# Altium schematic sheet Solar Batter Charger SCH_1.SchDoc
size A3; SheetNumber: 1; SheetTotal: 3
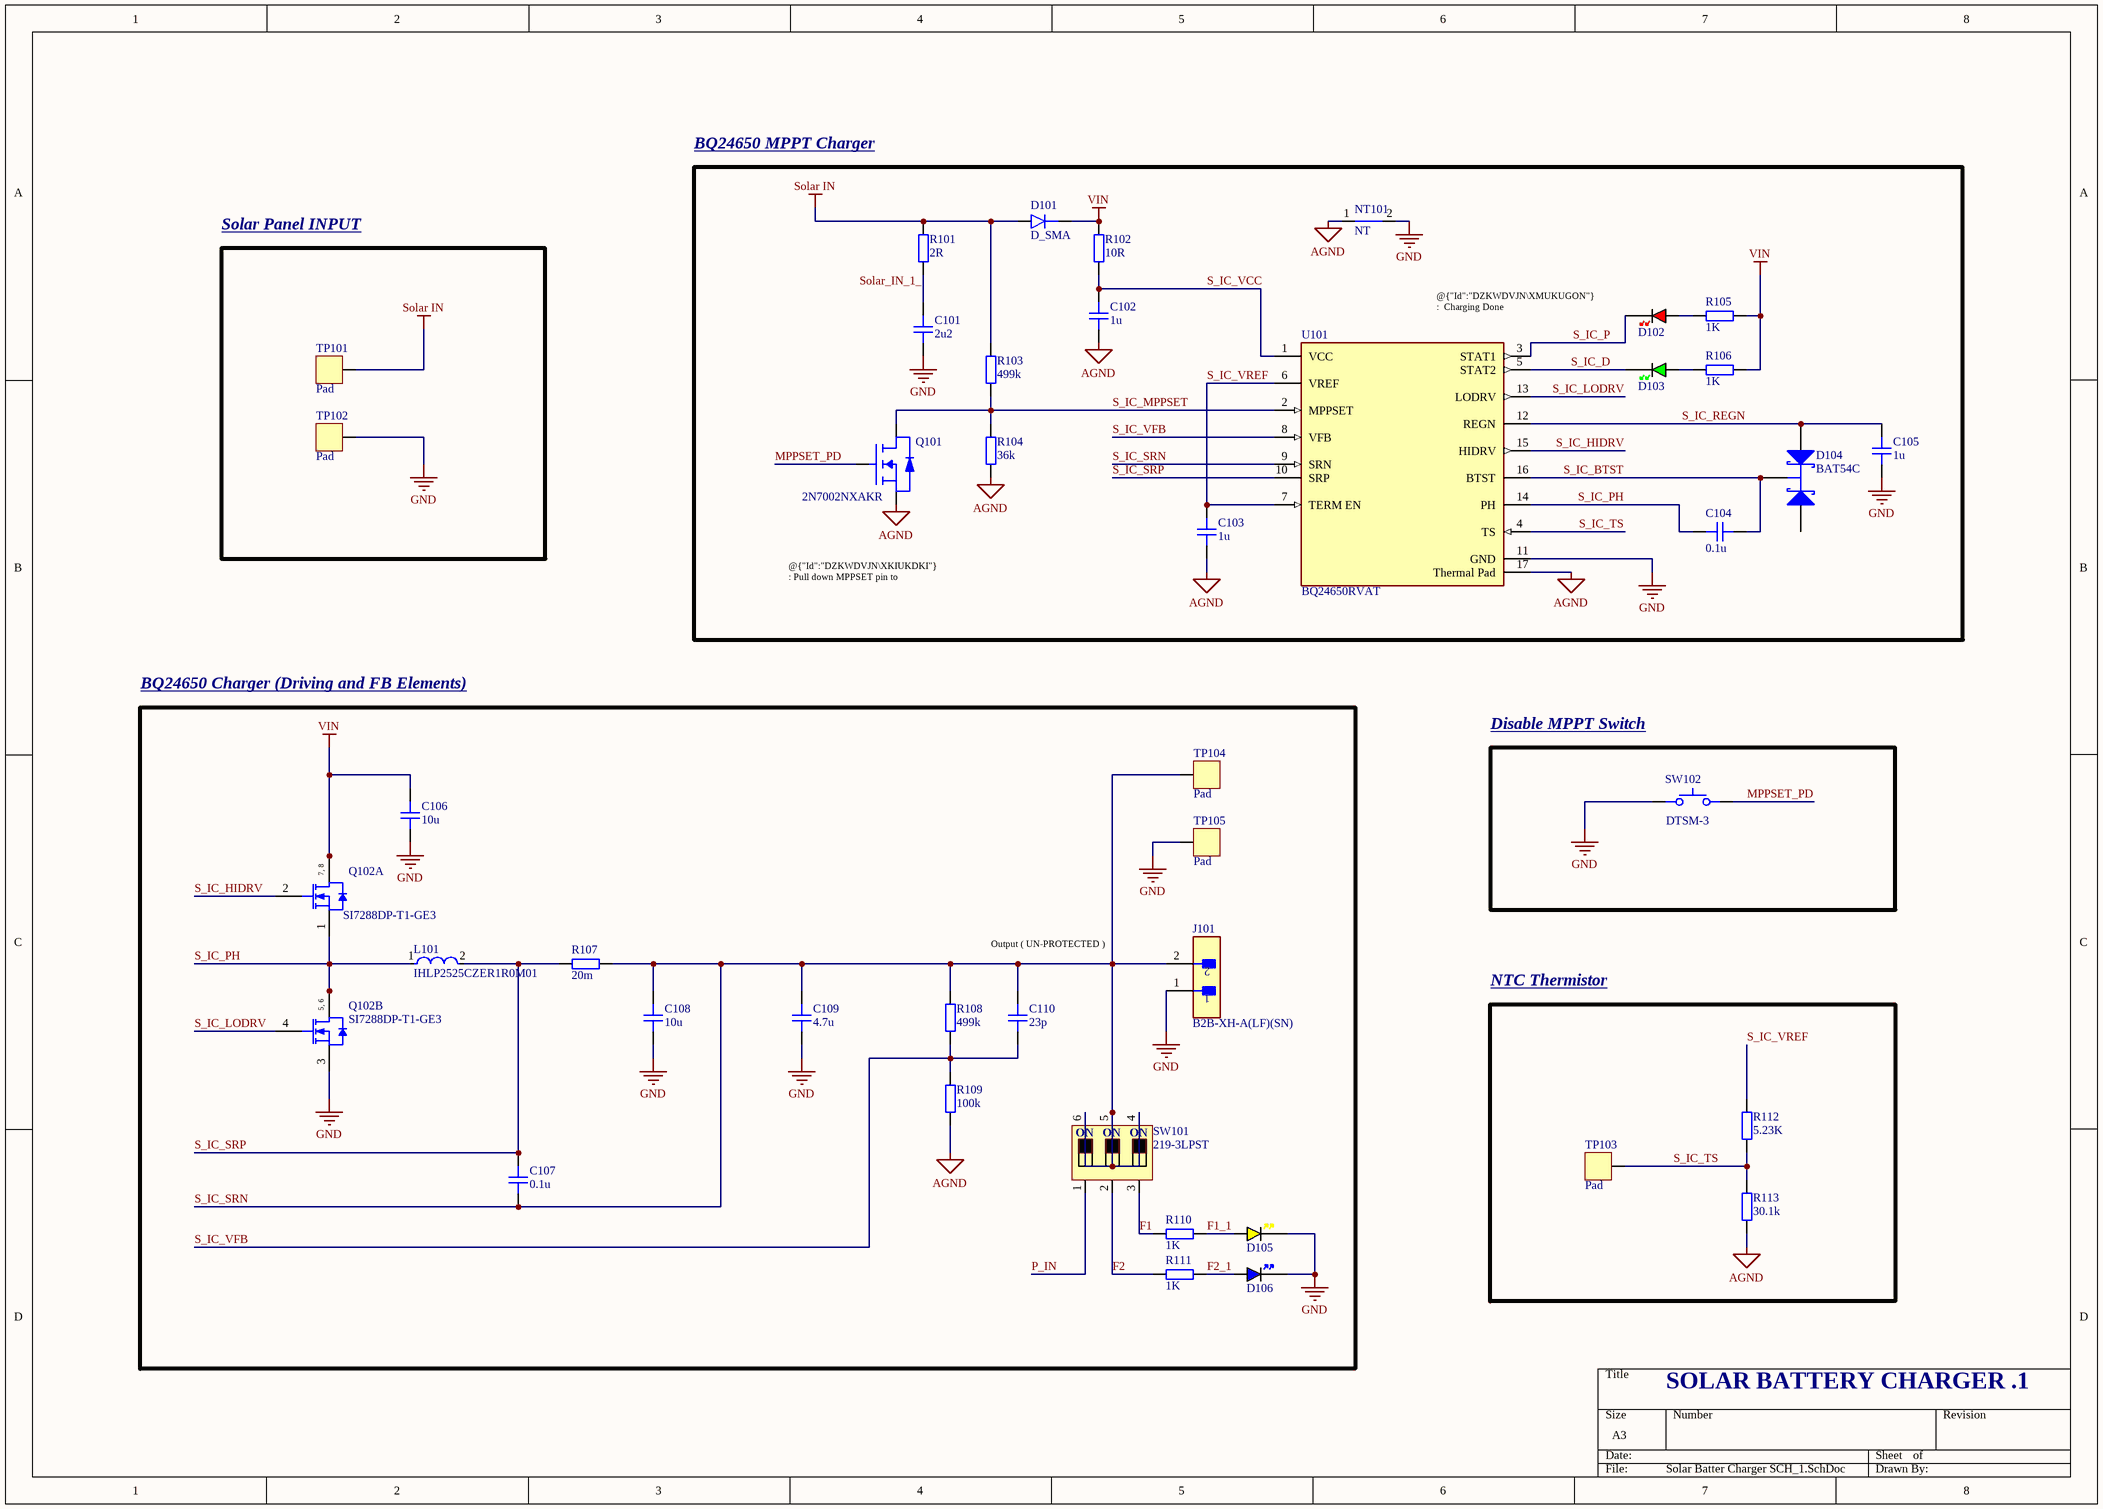
[diagram p0: Solar Batter Charger SCH_1.SchDoc]

## Parts
C101  2u2  [CAP_1210]
C102  1u  [CAP_0805]
C103  1u  [CAP_0402]
C104  0.1u  [CAP_0805]
C105  1u  [CAP_0805]
C106  10u  [CAP_1210]
C107  0.1u  [CAP_0805]
C108  10u  [CAP_1210]
C109  4.7u  [CAP_1210]
C110  23p  [CAP_0603]
D101  D_SMA  [DO-214AC-2 (SMA)]
D102  RED  [LED_0402_RED]  (value not drawn)
D103  GREEN  [LED_0402_GREEN]  (value not drawn)
D104  BAT54C  [NXP-SOT23-3_V]
D105  YELLOW  [LED_0603_YELLOW]  (value not drawn)
D106  BLUE  [LED_0603_BLUE]  (value not drawn)
J101  B2B-XH-A(LF)(SN)  [FP-B2B-XH-A_LF_SN-MFG]
L101  IHLP2525CZER1R0M01  [FP-IHLP-2525CZ-FP_2_413x3-MFG]
NT101  NT  [NETTIE_SMD]  (net tie, no BOM)
Q101  2N7002NXAKR  [SSM3J338R,LF-SOT23-F]
Q102  SI7288DP-T1-GE3  [VISH-POWERPAKSO-8_A_V]  (parts A,B of 2)
R101  2R  [RES_1206]
R102  10R  [RES_1206]
R103  499k  [RES_0402]
R104  36k  [RES_0402]
R105  1K  [RES_0402]
R106  1K  [RES_0402]
R107  20m  [RES_1206]
R108  499k  [RES_0402]
R109  100k  [RES_0402]
R110  1K  [RES_0402]
R111  1K  [RES_0402]
R112  5.23K  [RES_0402]
R113  30.1k  [RES_0402]
SW101  219-3LPST  [219-3LPST]
SW102  DTSM-3  [DTSM-3]
TP101  Pad  [PAD_SQ_2MM]  (no BOM)
TP102  Pad  [PAD_SQ_2MM]  (no BOM)
TP103  Pad  [PAD_SQ_2MM]  (no BOM)
TP104  Pad  [PAD_SQ_2MM]  (no BOM)
TP105  Pad  [PAD_SQ_2MM]  (no BOM)
U101  BQ24650RVAT  [FP-RVA0016A-MFG]

## Blocks framed on the sheet
BQ24650 MPPT Charger: C101-C105 D101-D104 NT101 Q101 R101-R106 U101
Solar Panel INPUT: TP101 TP102
BQ24650 Charger (Driving and FB Elements): C106-C110 D105 D106 J101 L101 Q102 R107-R111 SW101 TP104 TP105
Disable MPPT Switch: SW102
NTC Thermistor: R112 R113 TP103

## Nets
AGND: C102.1 C103.1 NT101.1 Q101.S R104.1 R109.1 R113.1 U101.17(Thermal_Pad)
GND: C101.1 C105.1 C106.1 C108.1 C109.1 D105.K D106.K J101.1 NT101.2 Q102.3(S2) SW102.1 TP102.1 TP105.1 U101.11(GND)
Solar IN: D101.A R101.2 R103.2 TP101.1
VIN: C106.2 D101.K Q102.7(D1) Q102.8(D1) R102.2 R105.2 R106.2
F1: R110.2 SW101.3
F1_1: D105.A R110.1
F2: R111.2 SW101.2
F2_1: D106.A R111.1
MPPSET_PD: Q101.G SW102.2
P_IN: SW101.1
S_IC_BTST: C104.1 D104.3(K) U101.16(BTST)
S_IC_D: D103.K U101.5(STAT2)
S_IC_HIDRV: Q102.2(G1) U101.15(HIDRV)
S_IC_LODRV: Q102.4(G2) U101.13(LODRV)
S_IC_MPPSET: Q101.D R103.1 R104.2 U101.2(MPPSET)
S_IC_P: D102.K U101.3(STAT1)
S_IC_PH: C104.2 L101.1 Q102.1(S1) Q102.5(D2) Q102.6(D2) U101.14(PH)
S_IC_REGN: C105.2 D104.2(A) U101.12(REGN)
S_IC_SRN: C107.2 C108.2 C109.2 C110.2 J101.2 R107.2 R108.2 SW101.4 SW101.5 SW101.6 TP104.1 U101.9(SRN)
S_IC_SRP: C107.1 L101.2 R107.1 U101.10(SRP)
S_IC_TS: R112.1 R113.2 TP103.1 U101.4(TS)
S_IC_VCC: C102.2 R102.1 U101.1(VCC)
S_IC_VFB: C110.1 R108.1 R109.2 U101.8(VFB)
S_IC_VREF: C103.2 R112.2 U101.6(VREF) U101.7(TERM_EN)
Solar_IN_1_: C101.2 R101.1
NetD102_A: D102.A R105.1
NetD103_A: D103.A R106.1

Not connected (* = marked no-connect by the designer): D104 1(A)

## Notes on the sheet
- (near U101) @{"Id":"DZKWDVJN\XMUKUGON"}  :  Charging Done
  @{"Id":"DZKWDVJN\OTPTDFPE"}   :  Charging in Progress
- @{"Id":"DZKWDVJN\XKIUKDKI"}  : Pull down MPPSET pin to disable charge.
- Output ( UN-PROTECTED )
- SOLAR BATTERY CHARGER .1
- (in symbol 219-3LPST) ON
- (in symbol CMP-2000-07062-1, part A) 7, 8
- (in symbol CMP-2000-07062-1, part B) 5, 6

## Library data of the parts
C101 C106 C108 C109 = CAP_1210: Capacitor SMD 1210; Manufacturer: *; Manufacturer Part Number: *; Distributor Link: *; LCSC: *; Rating: *; Dielectric: *
C102 C104 C105 C107 = CAP_0805: Capacitor SMD 0805; Manufacturer: *; Manufacturer Part Number: *; Distributor Link: *; LCSC: *; Rating: *; Dielectric: *
C103 = CAP_0402: Capacitor SMD 0402; Manufacturer: *; Manufacturer Part Number: *; Distributor Link: *; LCSC: *; Rating: *; Dielectric: *
C110 = CAP_0603: Capacitor SMD 0603; Manufacturer: *; Manufacturer Part Number: *; Distributor Link: *; LCSC: *; Rating: *; Dielectric: *
D101 = D_SMA: Diode SMD SMA (DO-214AA)
D102 = LED_0402_RED: LED 0402 RED SMD
D103 = LED_0402_GREEN: LED 0402 GREEN SMD
D104 = CMP-0417-00003-1: Schottky Barrier Diode, 30 V, 2 uA, -55 to 150 degC, 3-Pin SOT23, RoHS, Tape and Reel; Manufacturer: NXP Semiconductors; IR (uA): 2; VF (mV): 800; Trr (ns): 5; Cd (pF): 10; VR (V): 30; Rth(j-a) (K/W): 500; RoHS: TRUE; Packing: Tape and Reel; ComponentLink2URL: http://www.nxp.com/documents/data_sheet/BAT54_SER.pdf; PartNumber: BAT54C; ComponentLink2Description: Datasheet; Temperature Range: -55 to 150 degC; PackageReference: SOT23-3; PackageDescription: 3-Pin Plastic Surface-mounted Package, Body 1.3 x 2.9 mm, Pitch 0.95 mm; Mounting Technology: Surface Mount; ComponentLink1URL: http://www.nxp.com/; DatasheetVersion: Rev. 5; ComponentLink1Description: Manufacturer URL
D105 = LED_0603_YELLOW: LED 0603 YELLOW SMD
D106 = LED_0603_BLUE: LED 0603 BLUE SMD
J101 = CMP-2000-05888-3: CONN HEADER VERT 2POS 2.5MM; Current Rating: 3A; Voltage Rating: 250V; Number of Contacts: 2; Contact Resistance: 20mR; Wire/Cable Gauge: 22AWG; Insulation Resistance: 1GR; Connector Type: Male Pin; Packaging: Bulk; Contact Material: Brass; Lead Free: Lead Free; Orientation: Straight; Contact Plating: Tin; Max Current Rating: 3A; Termination: Solder; Fastening Type: Detent; Depth: 5.75mm; Housing Material: Polyamide; REACH SVHC: No SVHC; Series: XH; Voltage Rating (AC): 250V; Number of Positions: 2; Color: Natural; Contact Type: Male Pin; Max Voltage Rating (DC): 250V; Pitch: 2.5mm; Lead Pitch: 2.5mm; Mount: Through Hole; Max Operating Temperature: 85°C; Length: 7.4mm; Max Voltage Rating (AC): 250V; Min Operating Temperature: -25°C; Number of Rows: 1; Housing Color: White
L101 = CMP-02424-000599-1: Commercial Inductors, High Saturation Series 1uH 11A 10mΩ 20%; Self Resonant Frequency: 5MHz; Test Frequency: 100kHz; Shielding: Shielded; Core Material: Metal; Saturation Current: 22A; DC Resistance (DCR): 10mR; Current Rating: 11A; Packaging: Tape and Reel; Width: 6.47mm; Number of Pins: 2; Case/Package: 2525; Termination: SMD/SMT; Length: 7.24mm; Height: 3mm; Min Operating Temperature: -55°C; Mount: Surface Mount; Inductance Tolerance: 20%; Max Operating Temperature: 125°C; Military Standard: Not; Max DC Current: 11A; RMS Current (Irms): 11A; Lead Free: Lead Free; Depth: 6.72mm; Tolerance: 20%; Package Quantity: 2000; Radiation Hardening: No; Contact Plating: Tin; Inductance: 1uH
NT101 = NetTie_SMD: Net Tie SMD
Q101 = 2N7002NXAKR: MOSFET N-Channel Vds=60V Id=300mA with ESD Protection; Manufacturer: Nexperia; Manufacturer Part Number: 2N7002NXAKR
Q102 = CMP-2000-07062-1: Dual N-Channel (D-S) MOSFET, 40 V, 20 A, -55 to 150 degC, 8-Pin POWERPAKSO-8, RoHS, Tape and Reel; Manufacturer: Vishay; Gate Charge (Qg) @ Vgs: 15nC@10V; FET Feature: Standard; Rds On (Max) @ Id, Vgs: 19mOhm@10A,10V; Drain to Source Voltage (Vdss): 40V; Other Names: SI7288DP-T1-GE3DKR; Online Catalog: N-ChannelStandardFETs; Power - Max: 15.6W; PCN Assembly/Origin: MultipleFabracationChanges09/Jul/2014; Input Capacitance (Ciss) @ Vds: 565pF@20V; Current - Continuous Drain (Id) @ 25°C: 20A; Vgs(th) (Max) @ Id: 2.8V@250µA; FET Type: 2N-Channel(Dual); Package Reference: POWERPAKSO-8; Datasheet URL: http://www.vishay.com/docs/65366/si7288dp.pdf; Package Description: 8-Pin Surface Mount Device, Body 6.15 x 5.155 mm, Pitch 1.27 mm; Manufacturer URL: http://www.vishay.com/; Package / Case: PowerPAK®SO-8Dual; Category: DiscreteSemiconductorProducts; Mounting Type: SurfaceMount; Standard Package: 1; Mounting Technology: SurfaceMount; Series: TrenchFET®; Datasheet Version: Rev. A, 10/2009; Supplier Device Package: PowerPAK®SO-8Dual; Family: FETs-Arrays; Packaging: Digi-Reel®
R101 R102 R107 = RES_1206: Resistor SMD 1206; Manufacturer: *; Manufacturer Part Number: *; Distributor Link: *; LCSC: *
R103-R106 R108-R113 = RES_0402: Resistor SMD 0402; Manufacturer: *; Manufacturer Part Number: *; Distributor Link: *; LCSC: *
SW101 = 219-3LPST: DIP Switches SPST 3x; Manufacturer: CTS; Manufacturer Part Number: 219-3LPST
SW102 = DTSM-3: Tactile Switch SMD SPST; Manufacturer: Diptronics; Manufacturer Part Number: DTSM-3
TP101-TP105 = PAD_SQ_2MM: Test Point Square 2mm
U101 = CMP-0321-00203-3: IC SYNC SW-MODE BAT CHRGR 16VQFN; Max Output Voltage: 2.1V; Max Supply Voltage: 28V; Output Voltage: 26V; Operating Supply Current: 25mA; Number of Cells: 123456; Switching Frequency: 600kHz; Min Supply Voltage: 5V; Output Current: 10A; Length: 3.6mm; Width: 3.6mm; Case/Package: VQFN; REACH SVHC: No SVHC; Height: 0.95mm; Radiation Hardening: No; Max Operating Temperature: 125°C; Packaging: Tape and Reel; Package Quantity: 1; Number of Pins: 16; Min Input Voltage: 5V; Max Charge Current: 10A; Lead Free: Lead Free; RoHS Compliant: Yes; Min Operating Temperature: -40°C; Contact Plating: Gold; Weight: 0.001764oz